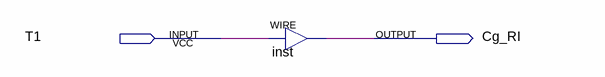
[diagram p0: schematic sheet]
// Quartus schematic abk_carga_ri.bdf as structural Verilog: 1 symbols, 2 pins
module abk_carga_ri (
  input  T1,
  output Cg_RI
);

  assign Cg_RI = T1;  // WIRE inst
endmodule
